# EAGLE schematic dl-11 (EAGLE 4.11)
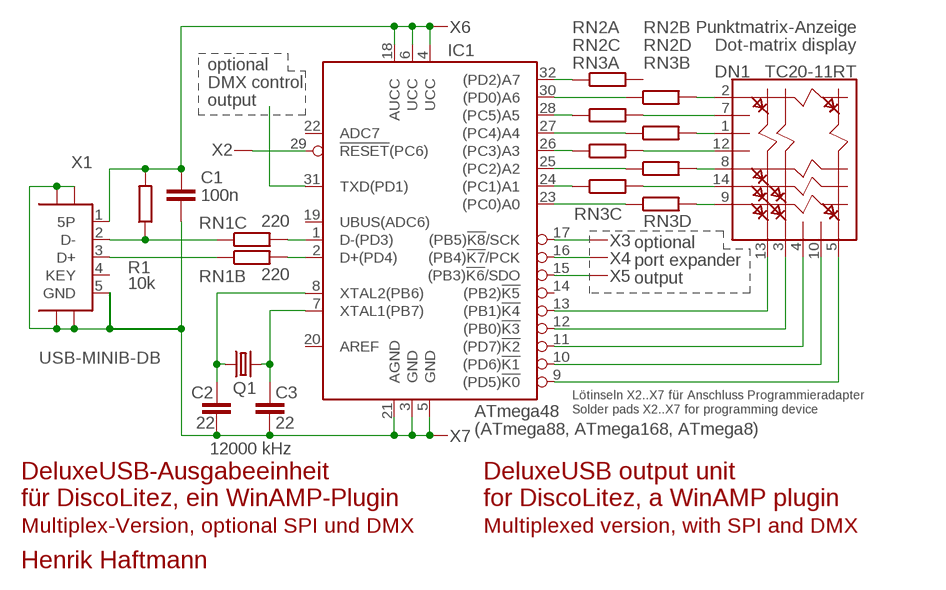
[diagram p0: schematic, sheet 1]

## Parts
C1  100n  C  [0603]
C2  22  C  [0603]
C3  22  C  [0603]
DN1  TC20-11RT  DOTMATRIX5X7CCL  [TA20-11]
IC1  ATmega48  MEGA48-TQ  [TQFP32-08]
Q1  12000 kHz  CRYSTALHC49S  [HC49/S]
R1  10k  R  [0603]
RN1  220  RN-4P1206  [R-4P]
RN2  RN-4P1206  [R-4P]
RN3  RN-4P1206  [R-4P]
X1  USB-MINIB-DB  [USB-DB]
X2  PADM  [SMD-1MM5]
X3  PADM  [SMD-1MM5]
X4  PADM  [SMD-1MM5]
X5  PADM  [SMD-1MM5]
X6  PADM  [SMD-1MM5]
X7  PADM  [SMD-1MM5]

## Nets
5P: C1.1 IC1.4(UCC) IC1.6(UCC) IC1.18(AUCC) R1.2 X1.1(5P) X6.1
A0: IC1.23((PC0)A0) RN3.4
A0': DN1.9(R1) RN3.5
A1: IC1.24((PC1)A1) RN3.3
A1': DN1.14(R2) RN3.6
A2: IC1.25((PC2)A2) RN3.2
A2': DN1.8(R3) RN3.7
A3: IC1.26((PC3)A3) RN3.1
A3': DN1.12(R4) RN3.8
A4: IC1.27((PC4)A4) RN2.4
A4': DN1.1(R5) RN2.5
A5: IC1.28((PC5)A5) RN2.3
A5': DN1.7(R6) RN2.6
A6: IC1.30((PD0)A6) RN2.2
A6': DN1.2(R7) RN2.7
A7: IC1.32((PD2)A7) RN2.1
D+: RN1.2 X1.3(D+)
D+': IC1.2(D+(PD4)) RN1.7
D-: R1.1 RN1.3 X1.2(D-)
D-': IC1.1(D-(PD3)) RN1.6
DMX: IC1.31(TXD(PD1))
GND: C1.2 C2.2 C3.2 IC1.3(GND) IC1.5(GND) IC1.21(AGND) X1.5(GND) X1.S1(GND) X1.S2(GND) X1.S3(GND) X1.S4(GND) X7.1
K0: DN1.5(C5) IC1.9((PD5)!K0)
K1: DN1.10(C4) IC1.10((PD6)!K1)
K2: DN1.4(C3) IC1.11((PD7)!K2)
K3: DN1.3(C2) IC1.12((PB0)!K3)
K4: DN1.13(C1) IC1.13((PB1)!K4)
PCK: IC1.16((PB4)!K7!/PCK) X4.1
RESET: IC1.29(!RESET!(PC6)) X2.1
SCK: IC1.17((PB5)!K8!/SCK) X3.1
SDO: IC1.15((PB3)!K6!/SDO) X5.1
XTAL1: C3.1 IC1.7(XTAL1(PB7)) Q1.2
XTAL2: C2.1 IC1.8(XTAL2(PB6)) Q1.1
Unconnected: IC1.14((PB2)!K5) IC1.19(UBUS(ADC6)) IC1.20(AREF) IC1.22(ADC7) RN1.1 RN1.4 RN1.5 RN1.8 RN2.8 X1.4(KEY)

## Notes on the sheet
- Punktmatrix-Anzeige
- Dot-matrix display
- optional
- DMX control
- output
- optional
- port expander
- output
- Lötinseln X2..X7 für Anschluss Programmieradapter
- Solder pads X2..X7 for programming device
- (ATmega88, ATmega168, ATmega8)
- DeluxeUSB-Ausgabeeinheit | DeluxeUSB output unit
- für DiscoLitez, ein WinAMP-Plugin | for DiscoLitez, a WinAMP plugin
- Multiplex-Version, optional SPI und DMX | Multiplexed version, with SPI and DMX
- Henrik Haftmann

## Library data of the parts
C1-C3 = dl:C: Kondensator
DN1 = dl:DOTMATRIX5X7CC: LED-Punktmatrix-Anzeige 5x7 Spalten = Katoden
IC1 = dl:MEGA*8-: 8-bit-Mikrocontroller 8bit, 16MHz, Harvard 4/8/16 Kbyte FLASH (schreibbar durch Firmware) 1 KByte RAM 0,5 KByte EEPROM 1x UART, 8 Kanal 10-bit-ADU, 2x Timer, I²C, SPI Achtung! Chaotisches Schaltbild nur passend für DiscoLitez-Ausgabeeinheit gemultiplext
Q1 = dl:CRYSTAL: Quarz 2 Anschlüsse
R1 = dl:R: Widerstand
RN1-RN3 = dl:RN-4P: Widerstandsnetzwerk 4 Parallel
X1 = dl:USB-MINIB: USB-MiniB-Buchse
X2-X7 = dl:PAD: Einfaches Lötpad